# Altium schematic sheet Sim7600Schematic.SchDoc
size A3
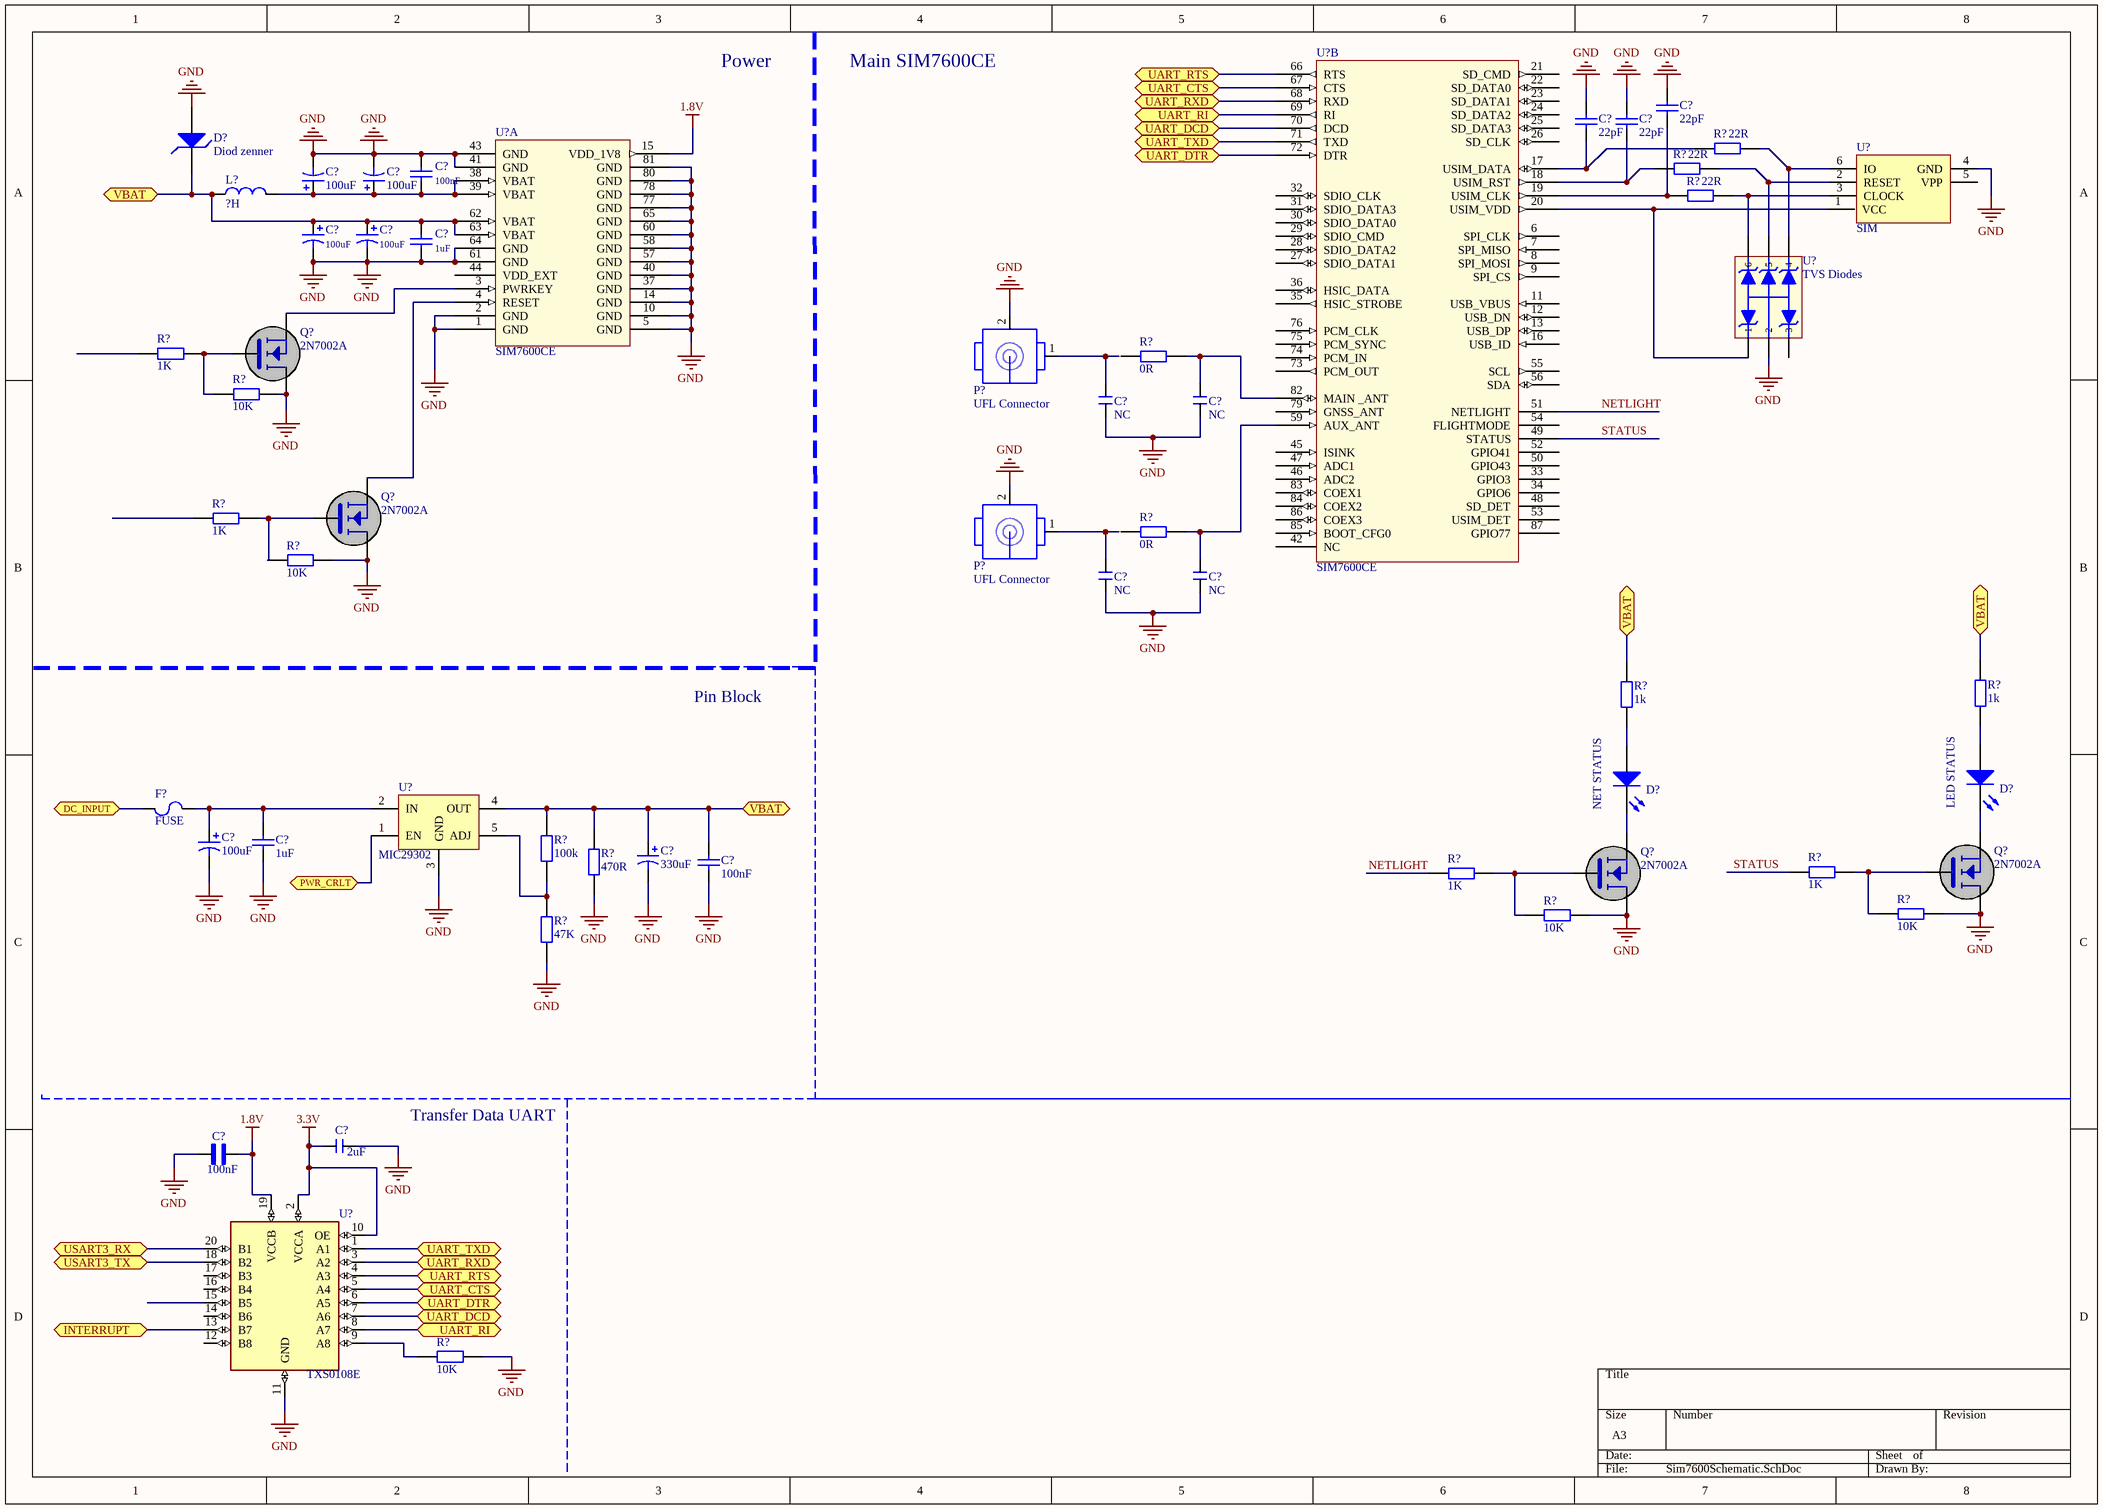
[diagram p0: Sim7600Schematic.SchDoc]

## Parts
(Parts that share a designator on the sheet are numbered #1, #2 ... from top to bottom, then left to right.)
C?#1  22pF
C?#2  22pF
C?#3  22pF
C?#4  100nF
C?#5  100uF
C?#6  100uF
C?#7  100uF
C?#8  100uF
C?#9  1uF
C?#10  NC  [CAPC 4.7uF 0603]
C?#11  NC  [CAPC 4.7uF 0603]
C?#12  NC  [CAPC 4.7uF 0603]
C?#13  NC  [CAPC 4.7uF 0603]
C?#14  100uF
C?#15  1uF
C?#16  330uF
C?#17  100nF
C?#18  2uF  [CAPC 4.7uF 0603]
C?#19  100nF  [CAP 0402]
D?#1  Diod zenner  [Diod Zener 1]
D?#2  LED STATUS  [LED2]
D?#3  NET STATUS  [LED2]
F?  FUSE  [FUSE-1206]
L?  ?H
P?#1  UFL Connector  [UFL Connector]
P?#2  UFL Connector  [UFL Connector]
Q?#1  2N7002A  [2N7002A]
Q?#2  2N7002A  [2N7002A]
Q?#3  2N7002A  [2N7002A]
Q?#4  2N7002A  [2N7002A]
R?#1  22R
R?#2  22R
R?#3  22R
R?#4  1K  [RES 0603 47R]
R?#5  0R  [RES 0603 47R]
R?#6  10K  [RES 0603 47R]
R?#7  1K  [RES 0603 47R]
R?#8  0R  [RES 0603 47R]
R?#9  10K  [RES 0603 47R]
R?#10  1k  [RES 0603 47R]
R?#11  1k  [RES 0603 47R]
R?#12  100k
R?#13  470R
R?#14  1K  [RES 0603 47R]
R?#15  1K  [RES 0603 47R]
R?#16  10K  [RES 0603 47R]
R?#17  10K  [RES 0603 47R]
R?#18  47K
R?#19  10K  [RES 0603 47R]
U?#1  SIM  [SIM-SOCKET1]
U?#2  SIM7600CE  [sim7600ce]  (part A of 2)
U?#3  SIM7600CE  [sim7600ce]  (part B of 2)
U?#4  TVS Diodes  [TVS Diod]
U?#5  MIC29302  [Microchip_MIC29302WU_0]
U?#6  TXS0108E  [PW_R-PDSO-G20]

## Ports
DC_INPUT, INTERRUPT, PWR_CRLT, UART_CTS, UART_DCD, UART_DTR, UART_RI, UART_RTS, UART_RXD, UART_TXD, USART3_RX, USART3_TX, VBAT

## Nets
1.8V: C?#19.2 U?#2.15(VDD_1V8) U?#6.19(VCCB)
3.3V: C?#18.?1 U?#6.2(VCCA) U?#6.10(OE)
GND: C?#1.2 C?#2.2 C?#3.2 C?#4.2 C?#5.2 C?#6.2 C?#7.2 C?#8.2 C?#9.1 C?#10.?1 C?#11.?1 C?#12.?1 C?#13.?1 C?#14.2 C?#15.1 C?#16.2 C?#17.1 C?#18.?2 C?#19.1 D?#1.1(A) P?#1.2 P?#2.2 Q?#1.3(D) Q?#2.3(D) Q?#3.3(D) Q?#4.3(D) R?#6.2 R?#9.2 R?#13.1 R?#16.2 R?#17.2 R?#18.1 R?#19.2 U?#1.4(GND) U?#2.1(GND) U?#2.2(GND) U?#2.5(GND) U?#2.10(GND) U?#2.14(GND) U?#2.37(GND) U?#2.40(GND) U?#2.41(GND) U?#2.43(GND) U?#2.57(GND) U?#2.58(GND) U?#2.60(GND) U?#2.61(GND) U?#2.64(GND) U?#2.65(GND) U?#2.77(GND) U?#2.78(GND) U?#2.80(GND) U?#2.81(GND) U?#4.9(2) U?#5.3(GND) U?#6.11(GND)
DC_INPUT: F?.3 ; port DC_INPUT
INTERRUPT: U?#6.13(B7) ; port INTERRUPT
NETLIGHT: R?#15.1 U?#3.51(NETLIGHT)
PWR_CRLT: U?#5.1(EN) ; port PWR_CRLT
STATUS: R?#14.1 U?#3.49(STATUS)
UART_CTS: U?#3.67(CTS) U?#6.5(A4) ; port UART_CTS
UART_DCD: U?#3.70(DCD) U?#6.7(A6) ; port UART_DCD
UART_DTR: U?#3.72(DTR) U?#6.6(A5) ; port UART_DTR
UART_RI: U?#3.69(RI) U?#6.8(A7) ; port UART_RI
UART_RTS: U?#3.66(RTS) U?#6.4(A3) ; port UART_RTS
UART_RXD: U?#3.68(RXD) U?#6.3(A2) ; port UART_RXD
UART_TXD: U?#3.71(TXD) U?#6.1(A1) ; port UART_TXD
USART3_RX: U?#6.20(B1) ; port USART3_RX
USART3_TX: U?#6.18(B2) ; port USART3_TX
VBAT: C?#7.1 C?#8.1 C?#9.2 C?#16.1 C?#17.2 D?#1.2(K) L?.5 R?#10.2 R?#11.2 R?#12.2 R?#13.2 U?#2.62(VBAT) U?#2.63(VBAT) U?#5.4(OUT) ; port VBAT
NetC?#1_1: C?#1.1 R?#3.1 U?#3.19(USIM_CLK)
NetC?#2_1: C?#2.1 R?#1.1 U?#3.17(USIM_DATA)
NetC?#3_1: C?#3.1 R?#2.1 U?#3.18(USIM_RST)
NetC?#4_1: C?#4.1 C?#5.1 C?#6.1 L?.4 U?#2.38(VBAT) U?#2.39(VBAT)
NetC?#10_?2: C?#10.?2 P?#1.1
NetC?#11_?2: C?#11.?2 R?#5.2 U?#3.82(MAIN__ANT)
NetC?#12_?2: C?#12.?2 P?#2.1
NetC?#13_?2: C?#13.?2 R?#8.2 U?#3.59(AUX_ANT)
NetC?#14_1: C?#14.1 C?#15.2 F?.4 U?#5.2(IN)
NetD?#2_1: D?#2.1(A) R?#11.1
NetD?#2_2: D?#2.2(K) Q?#3.2(S)
NetD?#3_1: D?#3.1(A) R?#10.1
NetD?#3_2: D?#3.2(K) Q?#4.2(S)
NetQ?#1_1: Q?#1.1(G) R?#4.2 R?#6.1
NetQ?#1_2: Q?#1.2(S) U?#2.3(PWRKEY)
NetQ?#2_1: Q?#2.1(G) R?#7.2 R?#9.1
NetQ?#2_2: Q?#2.2(S) U?#2.4(RESET)
NetQ?#3_1: Q?#3.1(G) R?#14.2 R?#17.1
NetQ?#4_1: Q?#4.1(G) R?#15.2 R?#16.1
NetR?#1_2: R?#1.2 U?#1.6(IO) U?#4.4
NetR?#2_2: R?#2.2 U?#1.2(RESET) U?#4.5
NetR?#3_2: R?#3.2 U?#1.3(CLOCK) U?#4.6
NetR?#12_1: R?#12.1 R?#18.2 U?#5.5(ADJ)
NetR?#19_1: R?#19.1 U?#6.9(A8)
NetU?#1_1: U?#1.1(VCC) U?#3.20(USIM_VDD) U?#4.1

Not connected (* = marked no-connect by the designer): R?#4 1; R?#5 1; R?#7 1; R?#8 1; U?#1 5(VPP); U?#2 44(VDD_EXT); U?#3 6(SPI_CLK) 7(SPI_MISO) 8(SPI_MOSI) 9(SPI_CS) 11(USB_VBUS) 12(USB_DN) 13(USB_DP) 16(USB_ID) 21(SD_CMD) 22(SD_DATA0) 23(SD_DATA1) 24(SD_DATA2) 25(SD_DATA3) 26(SD_CLK) 27(SDIO_DATA1) 28(SDIO_DATA2) 29(SDIO_CMD) 30(SDIO_DATA0) 31(SDIO_DATA3) 32(SDIO_CLK) 33(GPIO3) 34(GPIO6) 35(HSIC_STROBE) 36(HSIC_DATA) 42(NC) 45(ISINK) 46(ADC2) 47(ADC1) 48(SD_DET) 50(GPIO43) 52(GPIO41) 53(USIM_DET) 54(FLIGHTMODE) 55(SCL) 56(SDA) 73(PCM_OUT) 74(PCM_IN) 75(PCM_SYNC) 76(PCM_CLK) 79(GNSS_ANT) 83(COEX1) 84(COEX2) 85(BOOT_CFG0) 86(COEX3) 87(GPIO77); U?#4 3; U?#6 12(B8) 14(B6) 15(B5) 16(B4) 17(B3)

## Notes on the sheet
- Power
- Main SIM7600CE
- Pin Block
- Transfer Data UART

## Library data of the parts
C?#1-C?#4 C?#9 C?#15 C?#17 = Cap khong phan cuc
C?#5-C?#8 C?#14 C?#16 = Capacitor
C?#10-C?#13 C?#18 = Cap 2uf 0603
C?#19 = CAP 100nF
D?#2 D?#3 = LED
L? = Cuon cam Inductor
R?#1-R?#3 R?#12 R?#13 R?#18 = Resistor
R?#4-R?#11 R?#14-R?#17 R?#19 = RES 47R 0603
U?#1 = SIM_02
U?#6 = TXS0108E: Voltage Level Translator Bidirectional 1 Circuit 8 Channel 60Mbps 20-VQFN (3.5x4.5); MF: Texas Instruments; Purchase-URL: https://pricing.snapeda.com/search/part/TXS0108E/?ref=eda; Package: None; SnapEDA_Link: https://www.snapeda.com/parts/TXS0108E/Texas+Instruments/view-part/?ref=snap; Value: *; Check_prices: https://www.snapeda.com/parts/TXS0108E/Texas+Instruments/view-part/?ref=eda; Price: None; MP: TXS0108E; Availability: In Stock